# Altium schematic sheet [11]-POWER_BACKUP.SchDoc
size A4
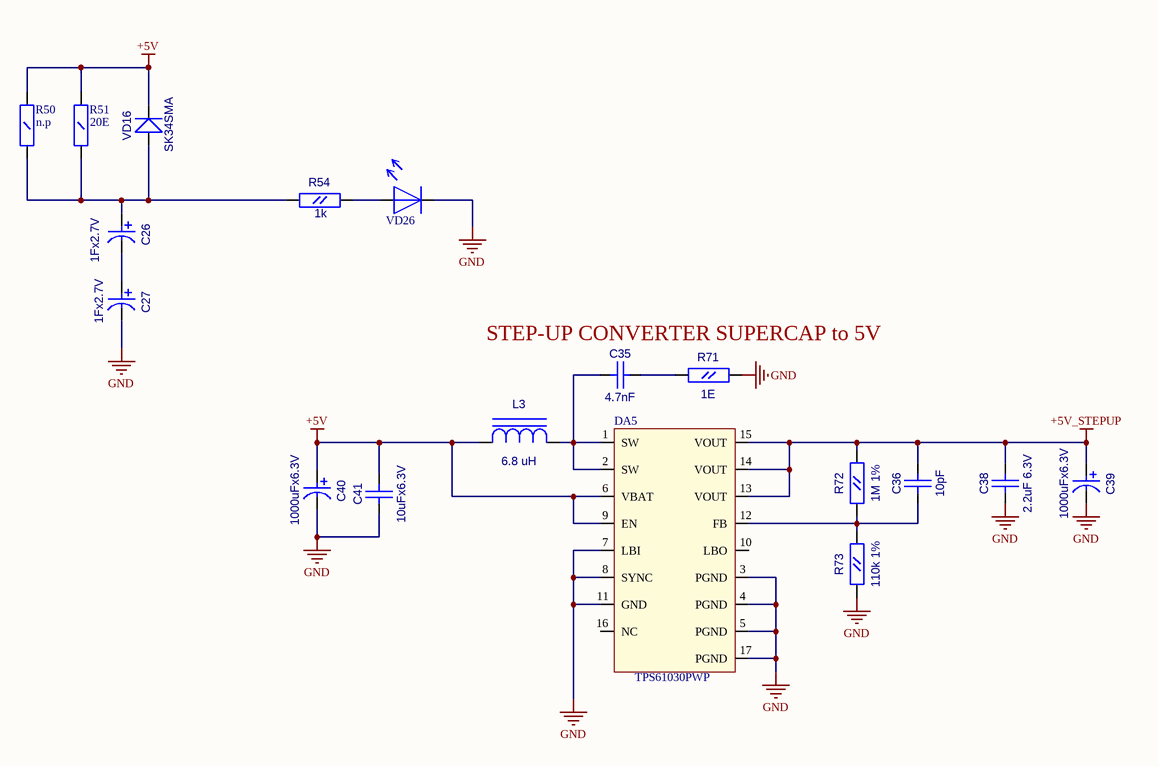
[diagram p0: [11]-POWER_BACKUP.SchDoc]

## Parts
C26  1Fx2.7V  [CC8X11.5_L]
C27  1Fx2.7V  [CC8X11.5_L]
C35  4.7nF  [CC0603]
C36  10pF  [CC0603]
C38  2.2uF 6.3V  [CC0805]
C39  value 1000uFx6.3V  [CC8X3.5]  (hidden comment: CAP0.35)
C40  value 1000uFx6.3V  [CC8X3.5]  (hidden comment: CAP0.35)
C41  10uFx6.3V  [CC0805]
DA5  TPS61030PWP  [R-PDSO-G16]
L3  6.8 uH  [SDR0805]
R50  n.p  [R2512]
R51  20E  [R2512]
R54  1k  [RC0603]
R71  1E  [RC0603]
R72  1M 1%  [RC0603]
R73  110k 1%  [RC0603]
VD16  SK34SMA  [SMA]
VD26  LED_0805  [LED0805]  (value not drawn)

## Nets
+5V: C40.1 C41.2(B) DA5.6(VBAT) DA5.9(EN) L3.1(C) R50.2(B) R51.2(B) VD16.2(K)
+5V_STEPUP: C36.2(B) C38.2(B) C39.1 DA5.13(VOUT) DA5.14(VOUT) DA5.15(VOUT) R72.2(B)
GND: C27.2 C38.1(A) C39.2 C40.2 C41.1(A) DA5.3(PGND) DA5.4(PGND) DA5.5(PGND) DA5.7(LBI) DA5.8(SYNC) DA5.11(GND) DA5.17(PGND) R71.2(B) R73.1(A) VD26.2
NetC26_1: C26.1 R50.1(A) R51.1(A) R54.1(A) VD16.1(A)
NetC26_2: C26.2 C27.1
NetC35_1: C35.1(A) DA5.1(SW) DA5.2(SW) L3.2(A)
NetC35_2: C35.2(B) R71.1(A)
NetC36_1: C36.1(A) DA5.12(FB) R72.1(A) R73.2(B)
NetR54_2: R54.2(B) VD26.1

Not connected (* = marked no-connect by the designer): DA5 10(LBO) 16(NC)

## Notes on the sheet
- STEP-UP CONVERTER SUPERCAP to 5V

## Library data of the parts
C26 C27 = CAP_8mm: Radial capacitor; Value: 1Fx2.7V
C35 C36 = CC0603
  C35: Value: 4.7nF
  C36: Value: 10pF
C38 C41 = CC0805
  C38: Value: 2.2uF 6.3V
  C41: Value: 10uFx6.3V
DA5 = TPS61030PWP: Boost converter
L3 = SDR0805: Value: 6.8 uH
R50 R51 = RC2512: Resistor 2512 1W
  R50: Value: n.p
  R51: Value: 20E
R54 R71-R73 = RC0603
  R54: Value: 1k
  R71: Value: 1E
  R72: Value: 1M 1%
  R73: Value: 110k 1%
VD16 = SK34SMA: Schottky Rectifier; Value: {Value}
VD26 = LED_0805: Value: LED_0805